# EAGLE design Untitled (EAGLE 6.5.0)
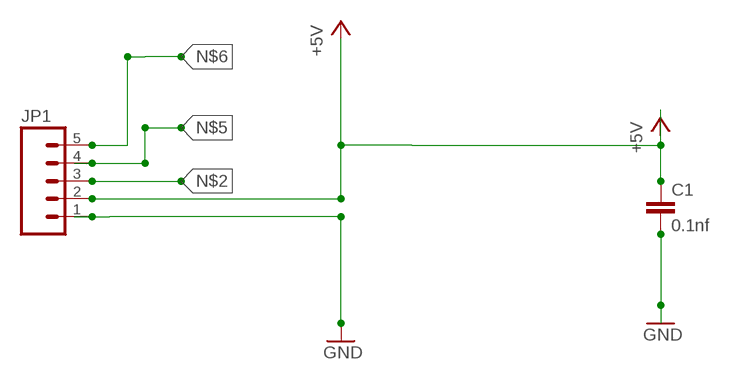
[diagram p0: schematic, sheet 1]

## Parts
C1  0.1nf  CAP0805  [0805]
JP1  M05PTH  [1X05]

## Nets
+5V: C1.1 JP1.2
GND: C1.2 JP1.1
N$2: JP1.3
N$5: JP1.4
N$6: JP1.5

## Library data of the parts
C1 = SparkFun-Passives:CAP: Capacitor Standard 0603 ceramic capacitor, and 0.1" leaded capacitor.
JP1 = SparkFun-Connectors:M05: Header 5 Standard 5-pin 0.1" header. Use with straight break away headers (SKU : PRT-00116), right angle break away headers (PRT-00553), swiss pins (PRT-00743), machine pins (PRT-00117), and female headers (PRT-00115). Molex polarized connector foot print use with SKU : PRT-08230 with associated crimp pins and housings.

## Board
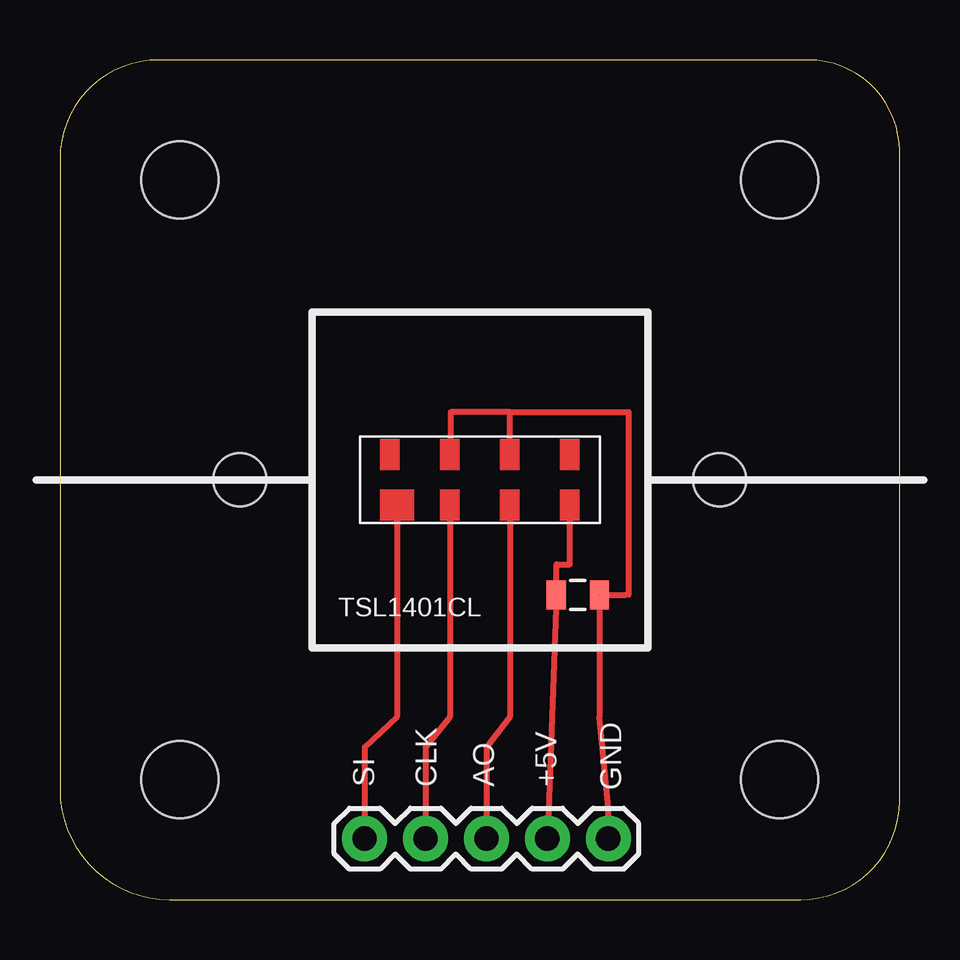
[diagram p1: board, top side]
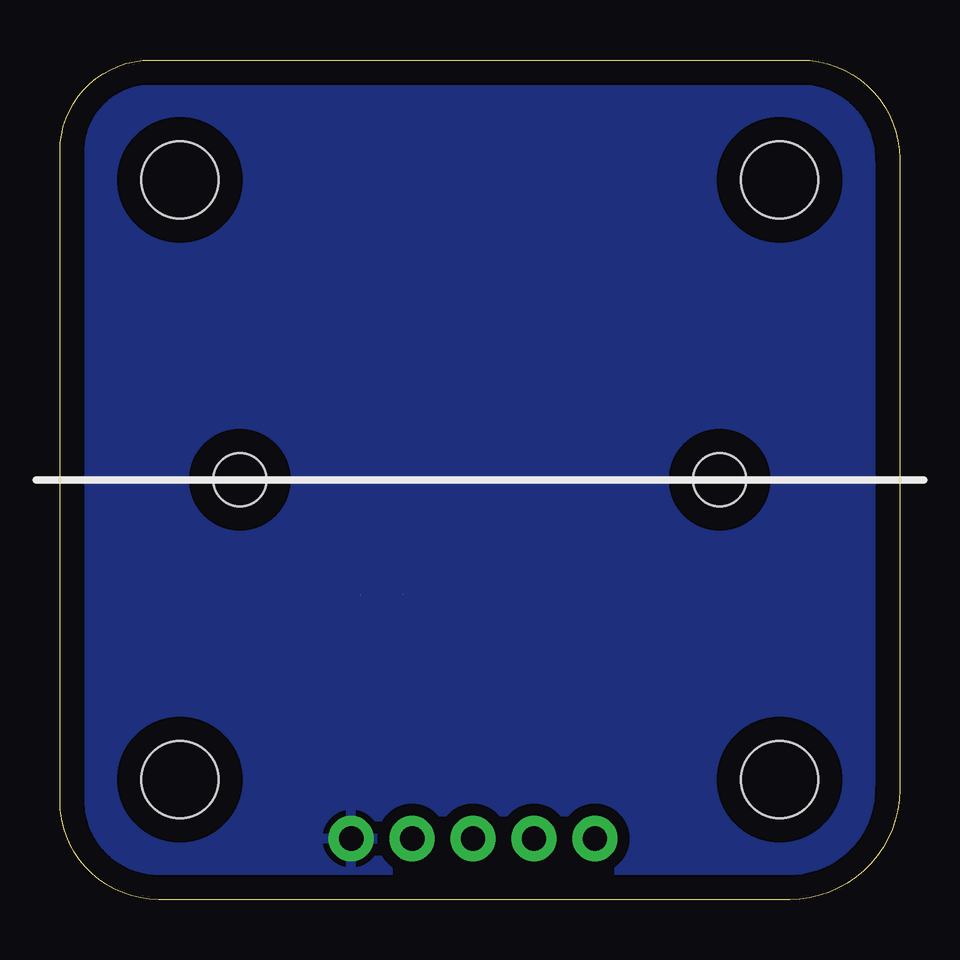
[diagram p2: board, bottom side, seen from below]

Size 35 x 35 mm. Coordinates in mm from the lower left corner, seen from the top.
Outline: 31.19,35 4.12,35 arc90 0,30.88 0,4.58 arc90 4.58,0 30.88,0 arc90 35,4.12 35,31.19 arc90 31.19,35
Copper layers (1*16): Top 0.035mm / dielectric 1.5mm / Bottom 0.035mm
Design rules "default": minimum track width 10mil, minimum drill 24mil, track to track 8mil, track to pad 8mil, pad to pad 8mil, via to via 8mil, smd to smd 8mil, copper to edge 40mil, drill to drill 8mil, minimum pad ring 10mil, minimum via ring 8mil, stop-mask expansion 4mil, vias tented up to drill 0mil, thermal gap 10mil
Holes 3.2 mm at 5,5 5,30 30,30 30,5
Holes 2.2 mm at 7.5,17.5 27.5,17.5

### Footprints (pad centres in the part's own frame; a part is rotated, then mirrored left to right if it is on the bottom)
0805 = smd 0.8 x 1.2: 1 -0.9,0; 2 0.9,0
1X05 = drill 1.016 pad 1.88: 1 0,0; 2 2.54,0; 3 5.08,0; 4 7.62,0; 5 10.16,0

### Placement (x,y rotation side)
C1  21.59,12.7 0 top
JP1  22.86,2.54 180 top

### Tracks (layer width: path | path; a pad name or v marks a point on that pad's centre or on a via)
+5V  (1 unrouted)
  Top 0.254: C1.1 JP1.2
GND  (1 unrouted)
  Top 0.254: C1.2 22.48,7.62 22.86,3.81 JP1.1
  pour Bottom (isolate 0.5): -1.27,34.29 -1.27,-1.27 41.91,-1.27 41.91,35.56 -1.27,35.56
N$1
  Top 0.254: 16.3,19.05 16.3,20.32 18.75,20.32 | 18.75,19.05 18.75,20.32 | 18.75,20.32 23.7,20.32 23.7,12.7
N$2
  Top 0.254: 18.75,16.51 18.75,7.62 17.78,6.35 JP1.3
N$3
  Top 0.254: 20.7,12.7 20.7,13.97
N$4
  Top 0.254: 20.7,13.97 21.25,13.97 21.25,15.9
N$5
  Top 0.254: 16.25,16.51 16.25,7.62 15.24,6.35 JP1.4
N$6
  Top 0.254: 14.05,16.51 14.05,7.62 12.7,6.35 JP1.5
S$1
  Top 0.254: 22.8,12.7 23.6,12.7
(copper drawn outside any net)
  shapes: Top area x8

### Text on the board
tNames: TSL1401CL | GND | SI | CLK | AO | +5V